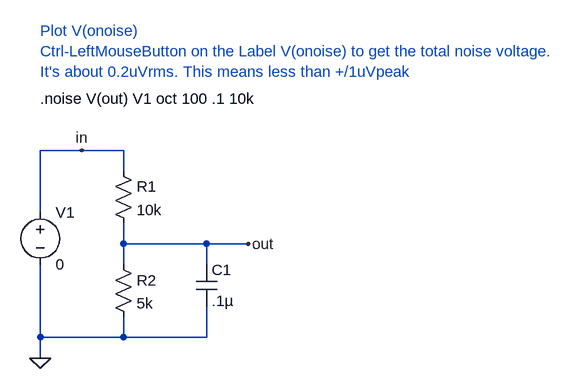
[diagram p0: schematic Resistive_divider_noise.asc]
Resistive_divider_noise.asc, the LTspice schematic file:
Version 4
SHEET 1 880 680
WIRE -80 240 -80 144
WIRE -80 432 -80 320
WIRE -80 464 -80 432
WIRE -16 144 -80 144
WIRE 48 144 -16 144
WIRE 48 176 48 144
WIRE 48 288 48 256
WIRE 48 320 48 288
WIRE 48 432 -80 432
WIRE 48 432 48 400
WIRE 176 288 48 288
WIRE 176 320 176 288
WIRE 176 432 48 432
WIRE 176 432 176 384
WIRE 240 288 176 288
FLAG -80 464 0
FLAG 240 288 out
FLAG -16 144 in
SYMBOL res 32 160 R0
SYMATTR InstName R1
SYMATTR Value 10k
SYMBOL res 32 304 R0
SYMATTR InstName R2
SYMATTR Value 5k
SYMBOL voltage -80 224 R0
SYMATTR InstName V1
SYMATTR Value 0
SYMBOL cap 160 320 R0
SYMATTR InstName C1
SYMATTR Value .1µ
TEXT -80 64 Left 0 !.noise V(out) V1 oct 100 .1 10k
TEXT -80 -40 Left 0 ;Plot V(onoise)\nCtrl-LeftMouseButton on the Label V(onoise) to get the total noise voltage.\nIt's about 0.2uVrms. This means less than +/1uVpeak

The netlist it stands for:
* Resistive_divider_noise.asc
R1 in out 10k
R2 out 0 5k
V1 in 0 0
C1 out 0 .1µ
.noise V(out) V1 oct 100 .1 10k
* Plot V(onoise)
* Ctrl-LeftMouseButton on the Label V(onoise) to get the total noise voltage.
* It's about 0.2uVrms. This means less than +/1uVpeak
.backanno
.end